# EAGLE design optMotorDriver (EAGLE 9.5.1)
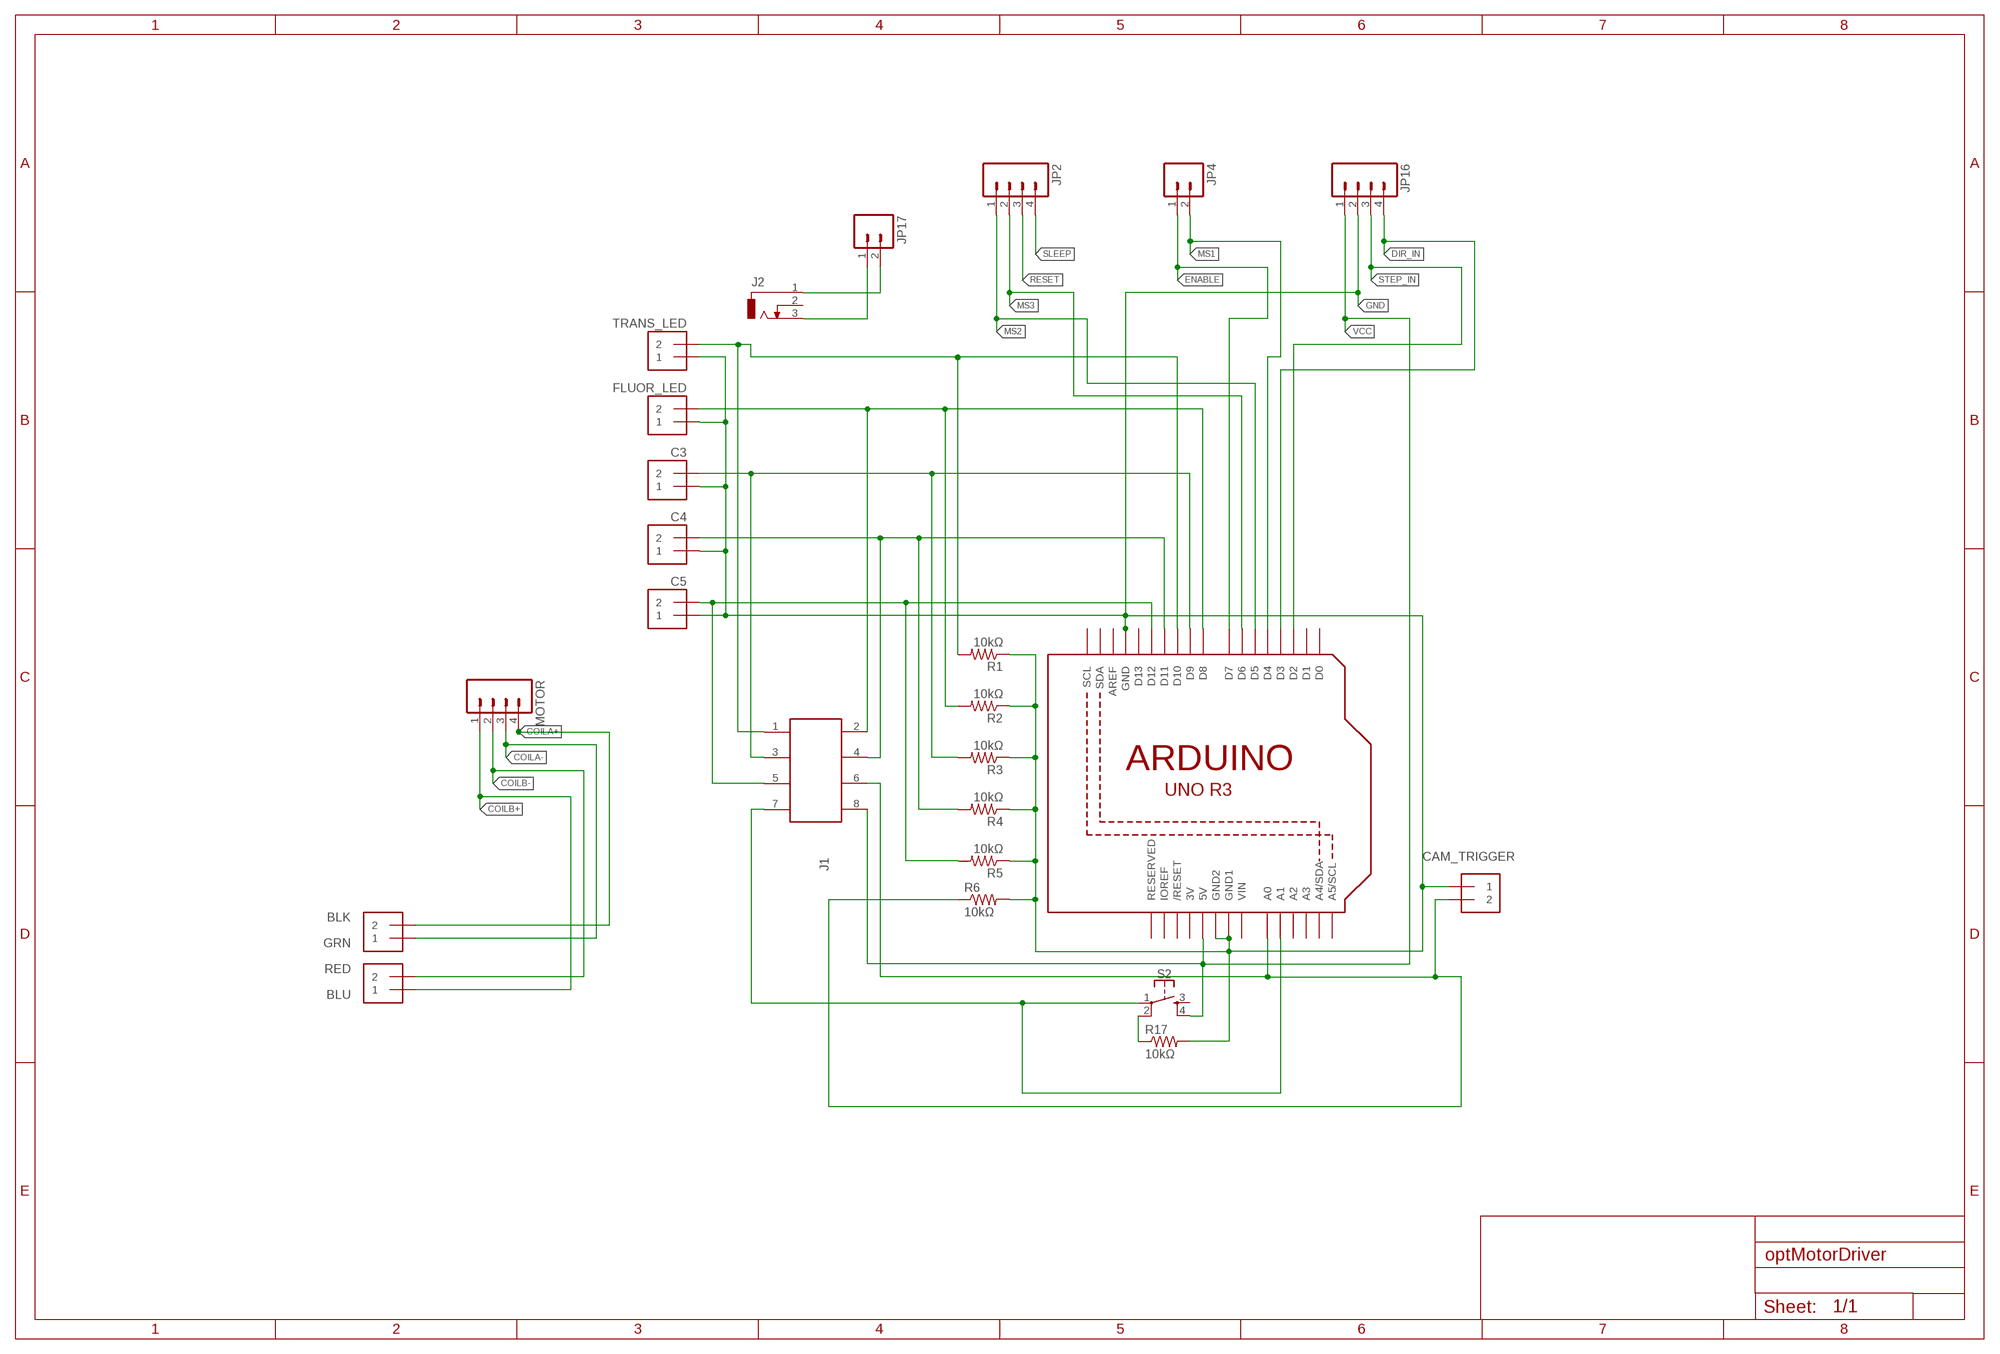
[diagram p0: schematic, sheet 1]

## Parts
ACOIL  1X2-3.5MM  [1X2-3.5MM]
BCOIL  1X2-3.5MM  [1X2-3.5MM]
C1  1X2-3.5MM  [1X2-3.5MM]
C2  1X2-3.5MM  [1X2-3.5MM]
C3  1X2-3.5MM  [1X2-3.5MM]
C4  1X2-3.5MM  [1X2-3.5MM]
C5  1X2-3.5MM  [1X2-3.5MM]
J1  62400821722  [62400821722]
J2  DCJ0303  [DCJ0303]
JP2  M04PTH  [1X04]
JP4  M02PTH  [1X02]
JP16  M04PTH  [1X04]
JP17  M02PTH  [1X02]
MOTOR  M04PTH  [1X04]
R1  10kΩ  R-US_R1206  [R1206]
R2  10kΩ  R-US_R1206  [R1206]
R3  10kΩ  R-US_R1206  [R1206]
R4  10kΩ  R-US_R1206  [R1206]
R5  10kΩ  R-US_R1206  [R1206]
R6  10kΩ  R-US_R1206  [R1206]
R17  10kΩ  R-US_R1206  [R1206]
S2  MOMENTARY-SWITCH-SPST-2-SMD-5.2MM  [TACTILE_SWITCH_SMD_5.2MM]
TRIGGER  1X2-3.5MM  [1X2-3.5MM]
U1  ARDUINOR3-DIMENSION  [ARDUINOR3]

## Nets
COILA+: ACOIL.2 MOTOR.4
COILA-: ACOIL.1 MOTOR.3
COILB+: BCOIL.1 MOTOR.1
COILB-: BCOIL.2 MOTOR.2
DIR_IN: JP16.4 U1.D3
ENABLE: JP4.1 U1.D7
GND: C1.1 C2.1 C3.1 C4.1 C5.1 JP16.2 R1.1 R2.1 R3.1 R4.1 R5.1 R6.2 R17.2 TRIGGER.1 U1.GND U1.GND1 U1.GND2
MS1: JP4.2 U1.D4
MS2: JP2.1 U1.D5
MS3: JP2.2 U1.D6
N$1: J2.3 JP17.1
N$2: C4.2 J1.4 R4.2 U1.D11
N$3: J2.1 JP17.2
N$6: C3.2 J1.3 R3.2 U1.D9
N$7: C5.2 J1.5 R5.2 U1.D12
N$8: J1.7 S2.1 U1.A1
N$13: J1.6 R6.1 TRIGGER.2 U1.A0
N$14: C2.2 J1.2 R2.2 U1.D8
N$15: C1.2 J1.1 R1.2 U1.D10
N$16: R17.1 S2.2
RESET: JP2.3
SLEEP: JP2.4
STEP_IN: JP16.3 U1.D2
VCC: J1.8 JP16.1 S2.4 U1.5V
Unconnected: J2.2 S2.3 U1.A2 U1.A3 U1.A4(A4/SDA) U1.A5(A5/SCL) U1.AREF U1.D0 U1.D1 U1.D13 U1.IOREF U1.RESERVED U1.RESET(/RESET) U1.SCL U1.SDA

## Power pins joined to a net without a drawn wire
3V: U1.3V
VIN: U1.VIN

## Library data of the parts
ACOIL BCOIL C1-C5 TRIGGER = adafruit:1X2: 3.5mm Terminal block http://www.ladyada.net/library/pcb/eaglelibrary.html
J1 = Wurth_Elektronik_Electromechanic_Wire_to_Board_Connectors_rev19a:62400821722: WR-WTB Wire-to-Board Connevtors 2.00mm-Dual Row Male Horizontal Shrouded Header, 8 Pins=>Code : WR-WTB_Stiftleiste_62400821722 <http://katalog.we-online.de/media/thumbs2/eican/thb_WR-WTB_Stiftleiste_6240xx21722.jpg> Details see: http://katalog.we-online.de/en/em/WTB_2_00_MALE_DUAL_ROW_HORIZONTAL_SHROUDED_HEADER_W_POSITIVE_LOCKING_6240XX21722 Created 2014-06-05, Karrer Zheng 2014 (C) Würth Elektronik
J2 = con-jack:DCJ0303: DC POWER JACK Source: DCJ0303.pdf; OC_FARNELL: unknown; OC_NEWARK: unknown
JP2 JP16 MOTOR = SparkFun:M04: Header 4 Standard 4-pin 0.1" header. Use with straight break away headers (SKU : PRT-00116), right angle break away headers (PRT-00553), swiss pins (PRT-00743), machine pins (PRT-00117), and female headers (PRT-00115). Molex polarized connector foot print use with SKU : PRT-08231 with associated crimp pins and housings. 1MM SMD Version SKU: PRT-10208
JP4 JP17 = SparkFun:M02: Header 2 Standard 2-pin 0.1" header. Use with straight break away headers (SKU : PRT-00116), right angle break away headers (PRT-00553), swiss pins (PRT-00743), machine pins (PRT-00117), and female headers (PRT-00115). Molex polarized connector foot print use with SKU : PRT-08233 with associated crimp pins and housings.
R1-R6 R17 = adafruit:R-US_: RESISTOR, American symbol
S2 = SparkFun-Switches:MOMENTARY-SWITCH-SPST-2: Momentary Switch (Pushbutton) - SPST - Two Circuits Normally-open (NO) SPST momentary switches (buttons, pushbuttons). Schematic symbol includes two switch circuits. Variants SMD-4.6MMX2.8MM - 4.60mm x 2.80mm Tactile Momentary Button Switch - Used on SparkFun SAMD21 Mini Breakout <https://www.sparkfun.com/products/13664> SMD-5.2MM - Mini Pushbutton Switch - SMD <https://www.sparkfun.com/products/8720> - Used on Arduino Pro Mini <https://www.sparkfun.com/products/11114>; PROD_ID: SWCH-08247; SF_SKU: COM-08720
U1 = adafruit:ARDUINOR3: This is a new object for the new Arduino R3 - with extra pins that you may want to use (such as IOref, and duplicated A4/A5

## Board
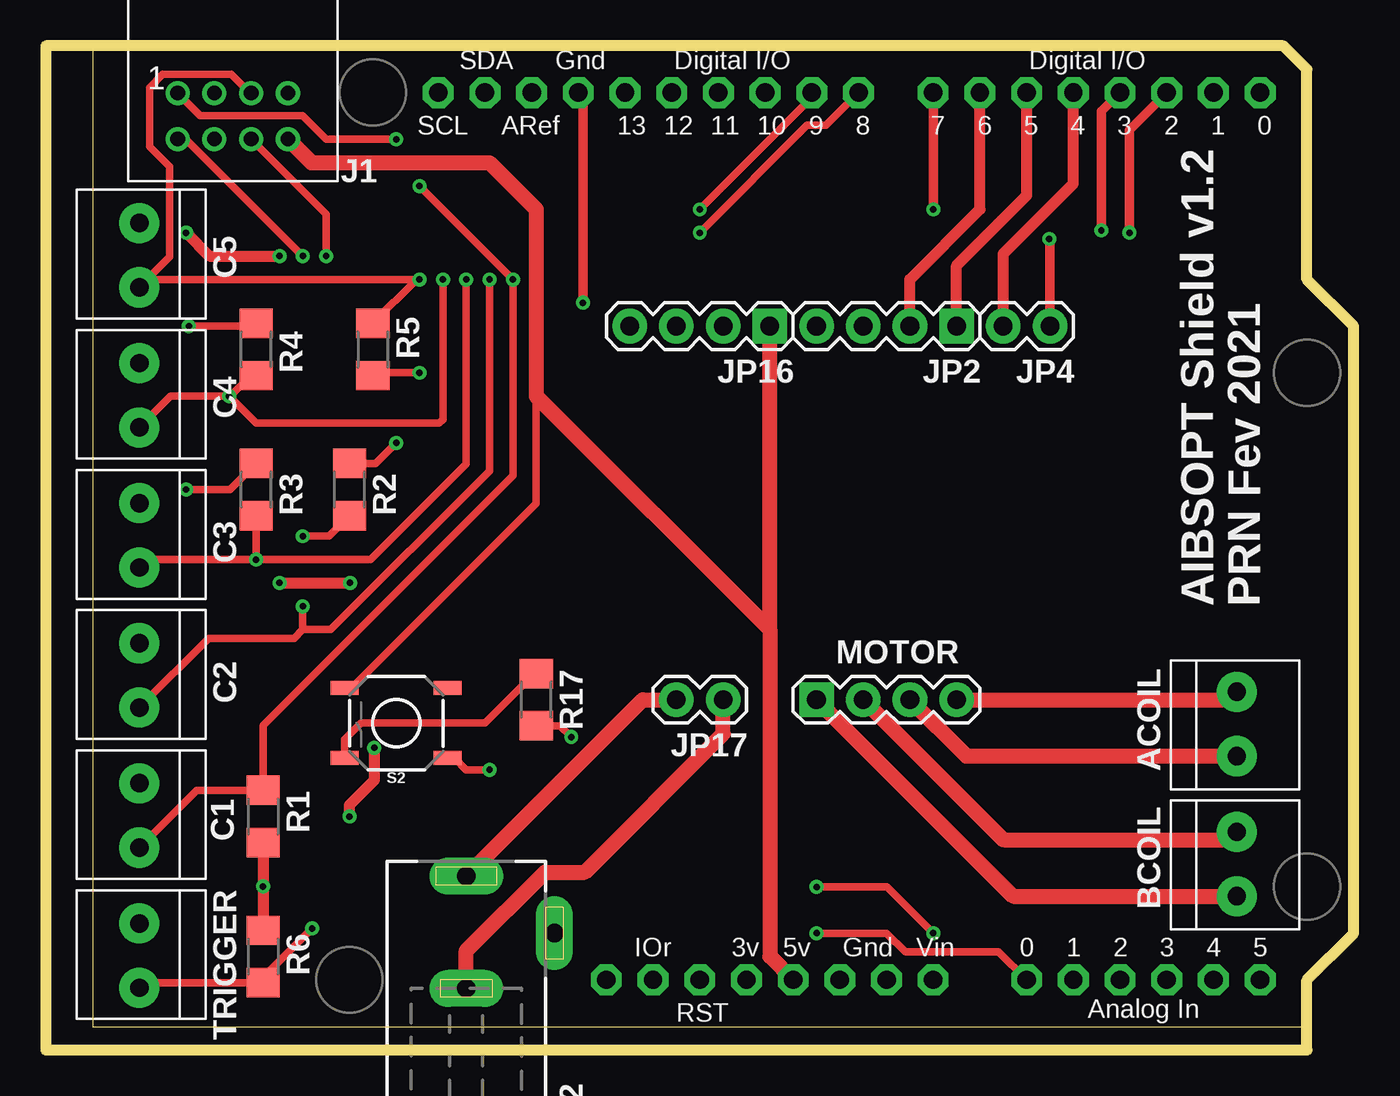
[diagram p1: board, top side]
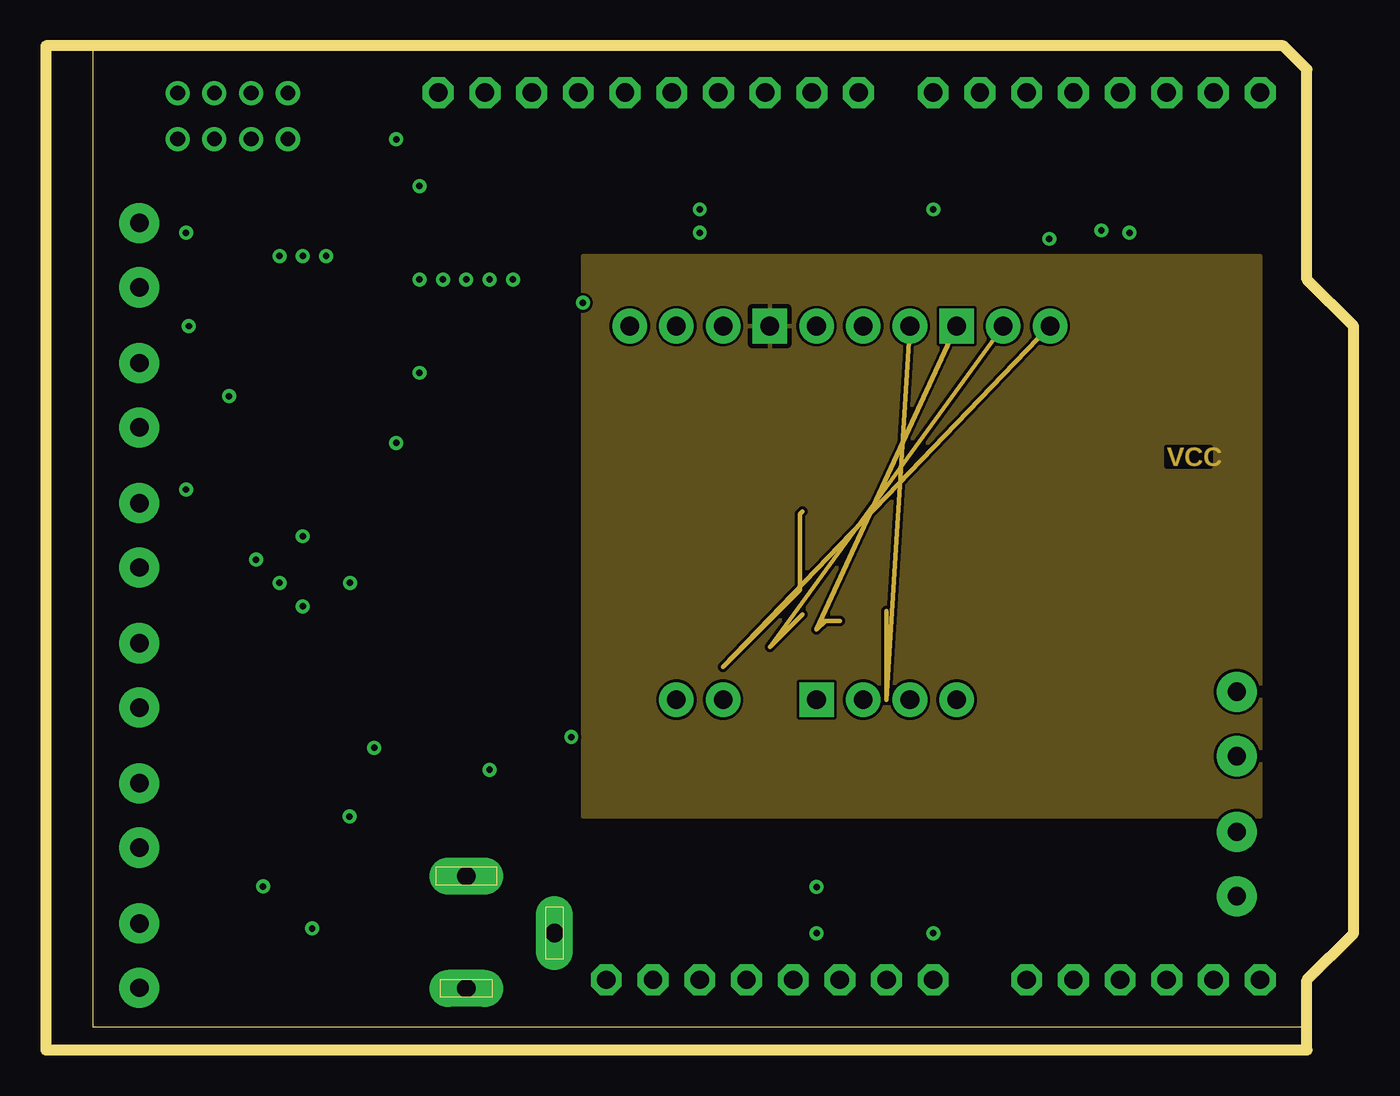
[diagram p2: board, inner layer Route2]
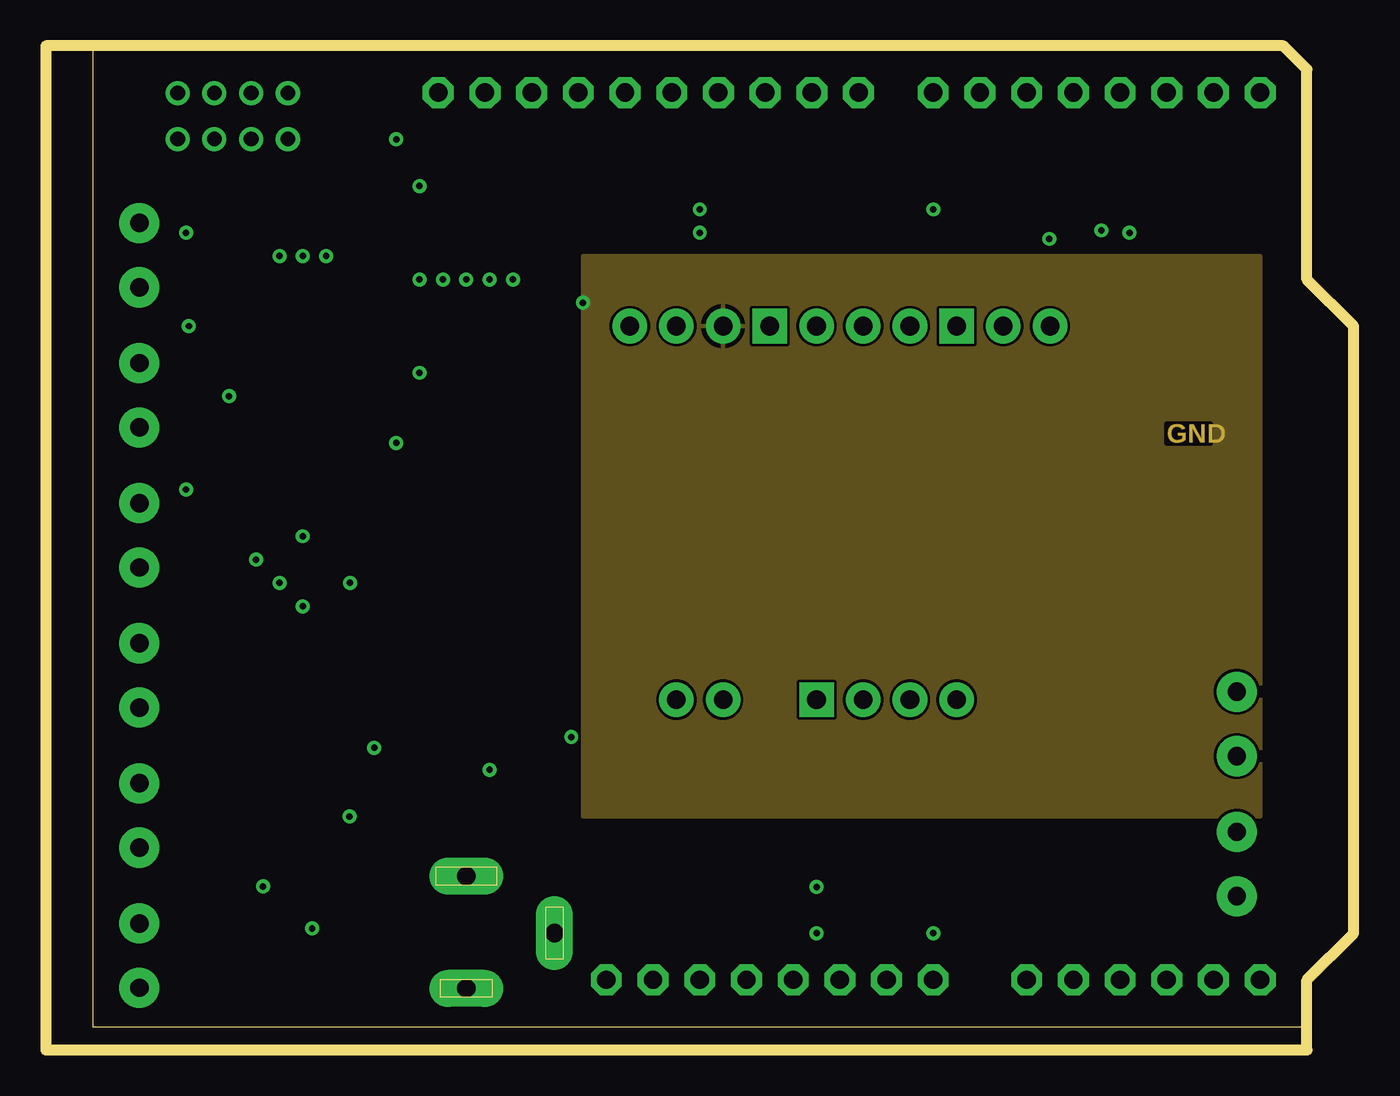
[diagram p3: board, inner layer Route15]
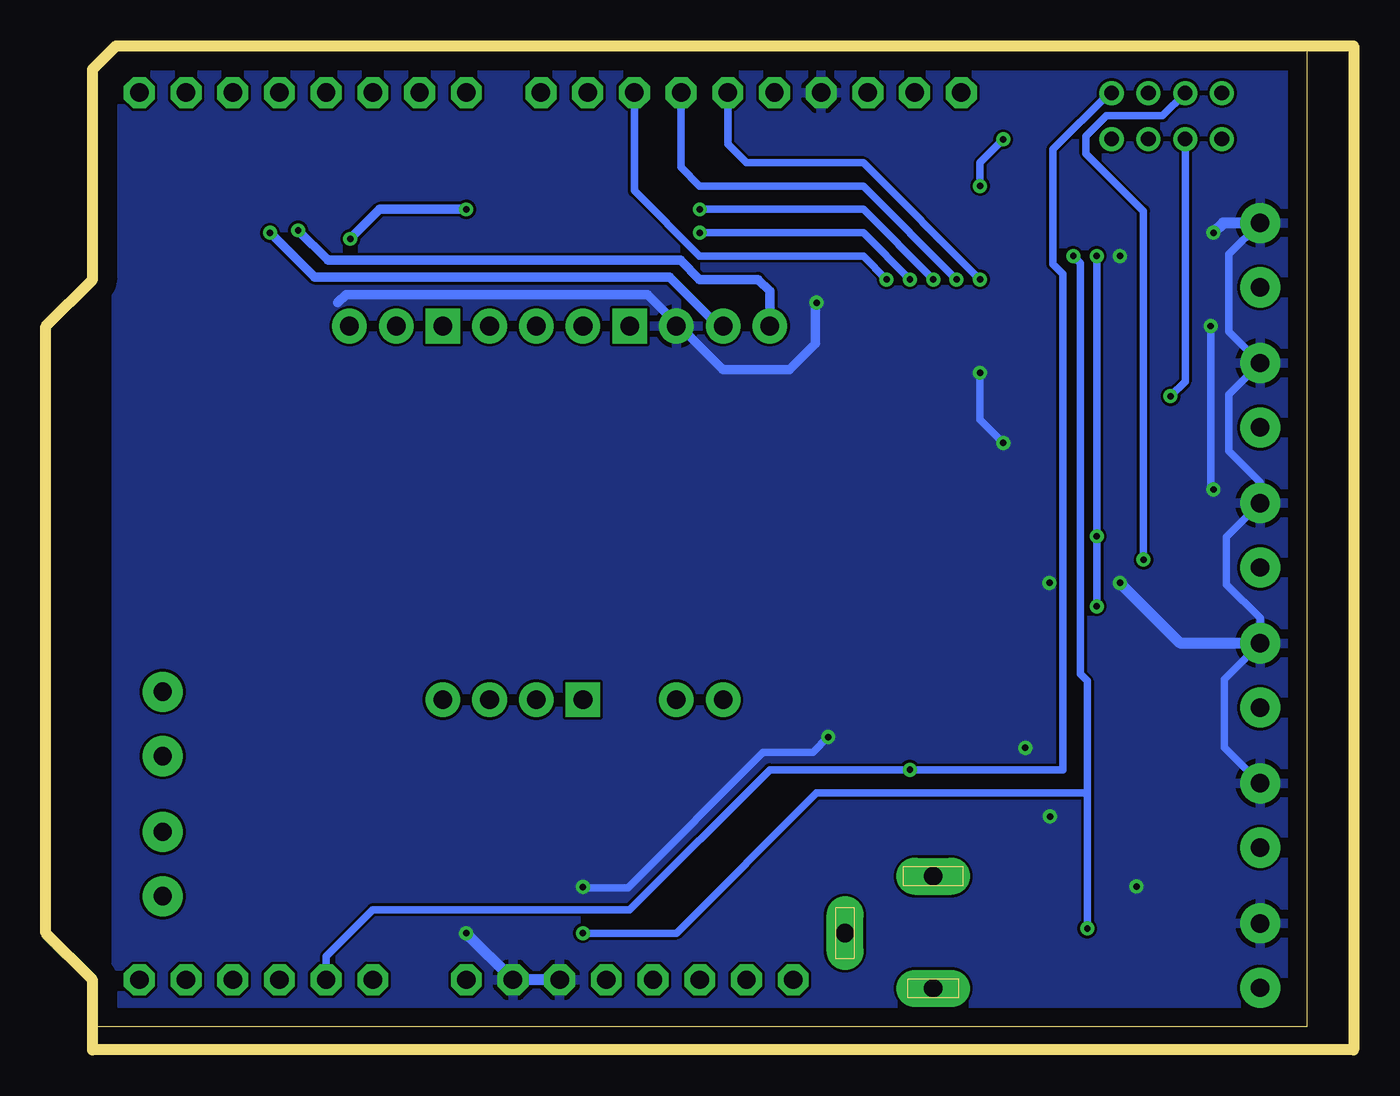
[diagram p4: board, bottom side, seen from below]

Size 71.12 x 54.61 mm. Coordinates in mm from the lower left corner, seen from the top.
Outline: 0,54.61 0,0 68.58,0 68.58,3.81 71.12,6.35 71.12,39.37 68.58,41.91 68.58,53.34 67.31,54.61 0,54.61
Copper layers (1*16): Top 0.035mm / dielectric 1.5mm / Bottom 0.035mm
Design rules "default": minimum track width 6mil, minimum drill 0.35mm, track to track 6mil, track to pad 6mil, pad to pad 6mil, via to via 6mil, smd to smd 6mil, copper to edge 40mil, drill to drill 6mil, minimum pad ring 10mil, minimum via ring 8mil, stop-mask expansion 4mil, vias tented up to drill 0mil, thermal gap 10mil

### Footprints (pad centres in the part's own frame; a part is rotated, then mirrored left to right if it is on the bottom)
1X2-3.5MM = drill 1 pad 2.184: 1 1.8,0; 2 -1.7,0
62400821722 = drill 0.8: 1 3,-1.25; 2 3,1.25; 3 1,-1.25; 4 1,1.25; 5 -1,-1.25; 6 -1,1.25; 7 -3,-1.25; 8 -3,1.25
DCJ0303 = drill 1 pad 2 long: 1 0,3.1; 2 4.8,0; 3 0,-3
1X04 = drill 1.016 pad 1.88 square: 1 0,0 | drill 1.016 pad 1.88: 2 2.54,0; 3 5.08,0; 4 7.62,0
1X02 = drill 1.016 pad 1.88: 1 0,0; 2 2.54,0
R1206 = smd 1.6 x 1.803: 1 -1.422,0; 2 1.422,0
TACTILE_SWITCH_SMD_5.2MM = smd 1.524 x 0.762: 1 -2.794,1.905; 2 2.794,1.905; 3 -2.794,-1.905; 4 2.794,-1.905
ARDUINOR3 = drill 1 pad 1.676 octagon: 3V 35.56,2.54; 5V 38.1,2.54; A0 50.8,2.54; A1 53.34,2.54; A2 55.88,2.54; A3 58.42,2.54; A4 60.96,2.54; A5 63.5,2.54; AREF 23.876,50.8; D0 63.5,50.8; D1 60.96,50.8; D2 58.42,50.8; D3 55.88,50.8; D4 53.34,50.8; D5 50.8,50.8; D6 48.26,50.8; D7 45.72,50.8; D8 41.656,50.8; D9 39.116,50.8; D10 36.576,50.8; D11 34.036,50.8; D12 31.496,50.8; D13 28.956,50.8; GND 26.416,50.8; GND1 43.18,2.54; GND2 40.64,2.54; IOREF 30.48,2.54; RESERVED 27.94,2.54; RESET 33.02,2.54; SCL 18.796,50.8; SDA 21.336,50.8; VIN 45.72,2.54

### Placement (x,y rotation side)
ACOIL  64.77,17.78 270 top
BCOIL  64.77,10.16 270 top
C1  5.08,12.7 90 top
C2  5.08,20.32 90 top
C3  5.08,27.94 90 top
C4  5.08,35.56 90 top
C5  5.08,43.18 90 top
J1  10.16,50.8 180 top
J2  22.86,6.35 0 top
JP2  49.53,39.37 180 top
JP4  54.61,39.37 180 top
JP16  39.37,39.37 180 top
JP17  36.83,19.05 180 top
MOTOR  41.91,19.05 0 top
R1  11.81,12.7 90 top
R2  16.51,30.48 270 top
R3  11.43,30.48 270 top
R4  11.43,38.1 270 top
R5  17.78,38.1 90 top
R6  11.81,5.08 90 top
R17  26.67,19.05 270 top
S2  19.05,17.78 180 top
TRIGGER  5.08,5.08 90 top
U1  2.54,1.27 0 top

### Tracks (layer width: path | path; a pad name or v marks a point on that pad's centre or on a via)
COILA+
  Top 0.813: MOTOR.4 64.34,19.05 ACOIL.2
COILA-
  Top 0.813: MOTOR.3 50.06,15.98 ACOIL.1
COILB+
  Top 0.813: MOTOR.1 52.6,8.36 BCOIL.1
COILB-
  Top 0.813: MOTOR.2 52.07,11.43 64.34,11.43 BCOIL.2
DIR_IN  (via drill 0.35)
  Top 0.508: U1.D3 57.4,51.05 v57.4,44.58
  Bottom 0.508: v57.4,44.58 55.78,42.95 36.6,42.95 35.56,41.91 32.39,41.91 31.75,41.27 JP16.4
ENABLE  (via drill 0.35)
  Top 0.508: U1.D7 v48.26,45.72 | v54.57,44.12 54.61,44.08 JP4.1
  Route2 0.254: JP4.1 36.83,20.83 41.02,25.02 41.02,29.16 41.15,29.29
  Bottom 0.508: v48.26,45.72 52.97,45.72 v54.57,44.12
GND  (via drill 0.35)
  Top 0.406: R17.2 27.96,17.63 v28.57,17.02 | R3.1 10.01,30.48 v7.62,30.48 | R2.1 17.93,31.9 v19.05,33.02 | R5.1 17.93,36.83 v20.32,36.83 | R4.1 11.28,39.37 v7.77,39.37 | v41.91,8.86 45.75,8.86 v48.26,6.35
  Top 0.508: U1.GND 29.21,51.82 v29.21,40.64
  Top 0.61: v12.7,25.4 v16.53,25.4 | v17.85,16.44 v17.86,16.43 17.86,14.67 16.51,13.32 v16.51,12.7 | v7.62,44.45 8.89,43.18 v12.7,43.18 | R1.1 v11.81,8.89 R6.2
  Bottom 0.406: C1.1 7.04,16.46 7.04,20.16 C2.1 5.08,23.5 6.91,25.32 6.91,27.91 C3.1 5.08,30.86 6.78,32.56 6.78,35.66 C4.1 6.78,39.06 6.78,43.28 C5.1 | v28.57,17.02 29.41,16.18 32.11,16.18 39.47,8.81 41.91,8.81 v41.91,8.86 | v7.62,30.48 7.77,30.63 v7.77,39.37 | v20.32,36.83 20.32,34.29 v19.05,33.02
  Bottom 0.508: 55.24,40.64 54.79,41.1 38.39,41.1 34.3,37.01 30.68,37.01 29.26,38.43 29.26,40.59 v29.21,40.64
  Bottom 0.61: C2.1 9.42,22.12 v12.7,25.4 | C5.1 7.09,44.98 v7.62,44.45 | U1.GND2 U1.GND1 v48.26,6.35
  pour Route15: 29.21,43.18 66.04,43.18 66.04,12.7 29.21,12.7
  pour Route15: -102.87,44.45 -66.04,44.45 -66.04,13.97 -102.87,13.97
  pour Route15: 113.03,7.62 76.2,7.62 76.2,38.1 113.03,38.1
  pour Bottom: 1.27,50.8 1.27,2.54 2.54,1.27 66.04,1.27 67.31,2.54 67.31,52.07 66.04,53.34 2.54,53.34 1.27,52.07
MS1
  Top 0.61: JP4.2 52.07,43.31 55.88,47.12 U1.D4
  Route2 0.254: JP4.2 39.37,21.91 41.15,23.69
MS2
  Top 0.61: JP2.1 49.53,42.67 53.34,46.48 U1.D5
  Route2 0.254: JP2.1 41.91,22.86 42.39,23.34 43.19,23.34
MS3
  Top 0.61: JP2.2 46.99,41.91 50.8,45.72 U1.D6
  Route2 0.254: 45.72,23.88 45.72,19.05 JP2.2
N$1
  Top 0.813: JP17.1 36.83,17.19 29.31,9.67 27.14,9.67 22.86,5.39 J2.3
N$2  (via drill 0.35)
  Top 0.406: v21.59,41.91 21.59,34.29 21.39,34.09 11.43,34.09 10,35.52 | 10,35.52 v9.96,35.56 6.78,35.56 C4.2 | R4.2 11.15,36.68 10,35.52
  Bottom 0.406: v21.59,41.91 26.67,46.99 35.56,46.99 36.58,48.01 U1.D11 | J1.4 9.16,36.36 v9.96,35.56
N$3
  Top 0.813: J2.1 32.46,19.05 JP17.2
N$6  (via drill 0.35)
  Top 0.406: C3.2 5.51,26.67 v11.43,26.67 | v11.43,26.67 17.65,26.67 22.86,31.88 v22.86,41.91 | v35.56,45.72 41.66,51.82 U1.D9 | R3.2 v11.43,26.67
  Bottom 0.406: v22.86,41.91 26.67,45.72 v35.56,45.72 | J1.3 10.4,50.81 13.45,50.81 14.55,49.71 14.55,48.75 11.43,45.63 v11.43,26.67
N$7  (via drill 0.35)
  Top 0.406: R5.2 20.17,41.91 v20.32,41.91 5.51,41.91 C5.2 6.74,43.14 6.74,48.03 5.64,49.13 5.64,52.34 6.36,53.06 10.09,53.06 11.1,52.05 J1.5
  Bottom 0.406: v20.32,41.91 26.67,48.26 33.02,48.26 34.04,49.28 U1.D12
N$8  (via drill 0.35)
  Top 0.406: v24.13,15.24 22.86,15.24 22.22,15.87 S2.1
  Bottom 0.406: U1.A1 55.88,5.08 53.34,7.62 39.37,7.62 31.75,15.24 v24.13,15.24 15.8,15.24 15.8,42.19 16.36,42.75 16.36,48.98 13.29,52.05 J1.7
N$13  (via drill 0.35)
  Top 0.406: TRIGGER.2 5.36,3.66 R6.1 11.81,3.94 v14.48,6.6 | U1.A0 51.82,5.33 46.74,5.33 45.72,6.35 v41.91,6.35 | J1.6 15.24,45.47 v15.24,43.18
  Bottom 0.406: v41.91,6.35 36.83,6.35 29.21,13.97 14.48,13.97 | v15.24,43.18 14.86,42.8 14.86,20.45 14.48,20.07 14.48,13.97 | 14.48,13.97 v14.48,6.6
N$14  (via drill 0.35)
  Top 0.406: C2.2 8.85,22.39 13.5,22.39 13.97,22.86 | 13.97,22.86 15.49,22.86 24.13,31.5 v24.13,41.91 | v35.56,44.45 41.4,50.29 42.42,50.29 U1.D8 | R2.2 15.39,27.94 v13.97,27.94 | v13.97,24.13 13.97,22.86 | v13.97,43.18 7.6,49.55 J1.2
  Bottom 0.406: v24.13,41.91 26.67,44.45 v35.56,44.45 | v13.97,24.13 v13.97,27.94 v13.97,43.18
N$15  (via drill 0.35)
  Top 0.406: C1.2 8.2,14.12 R1.2 11.81,17.65 25.4,31.24 v25.4,41.91 v20.32,46.99 | J1.1 8.4,50.81 13.96,50.81 15.24,49.53 v19.05,49.53
  Bottom 0.406: v25.4,41.91 26.67,43.18 35.56,43.18 39.12,46.74 U1.D10 | v19.05,49.53 20.32,48.26 v20.32,46.99
N$16
  Top 0.406: S2.2 16.26,16.89 17.14,17.78 23.88,17.78 26.57,20.47 R17.1
STEP_IN  (via drill 0.35)
  Top 0.508: U1.D2 58.93,50.04 v58.93,44.45
  Bottom 0.508: v58.93,44.45 56.52,42.04 37.21,42.04 34.54,39.37 JP16.3
VCC
  Top 0.406: 26.67,35.56 26.67,29.72 16.64,19.68 S2.4
  Top 0.813: J1.8 14.45,48.26 24.13,48.26 26.67,45.72 26.67,35.56 39.37,22.86 | U1.5V 39.37,5.08 39.37,22.86 | 39.37,22.86 JP16.1
  pour Route2: 29.21,43.18 66.04,43.18 66.04,12.7 29.21,12.7
  pour Route2: -102.87,44.45 -66.04,44.45 -66.04,13.97 -102.87,13.97
  pour Route2: 113.03,7.62 76.2,7.62 76.2,38.1 113.03,38.1

### Text on the board
Route2: VCC | VCC | VCC
Route15: GND | GND | GND
tNames: AIBSOPT Shield v1.2 | PRN Fev 2021